# Altium schematic sheet PowerSupply.SchDoc
size 420 x 297 mm; SheetNumber: 4; SheetTotal: 4
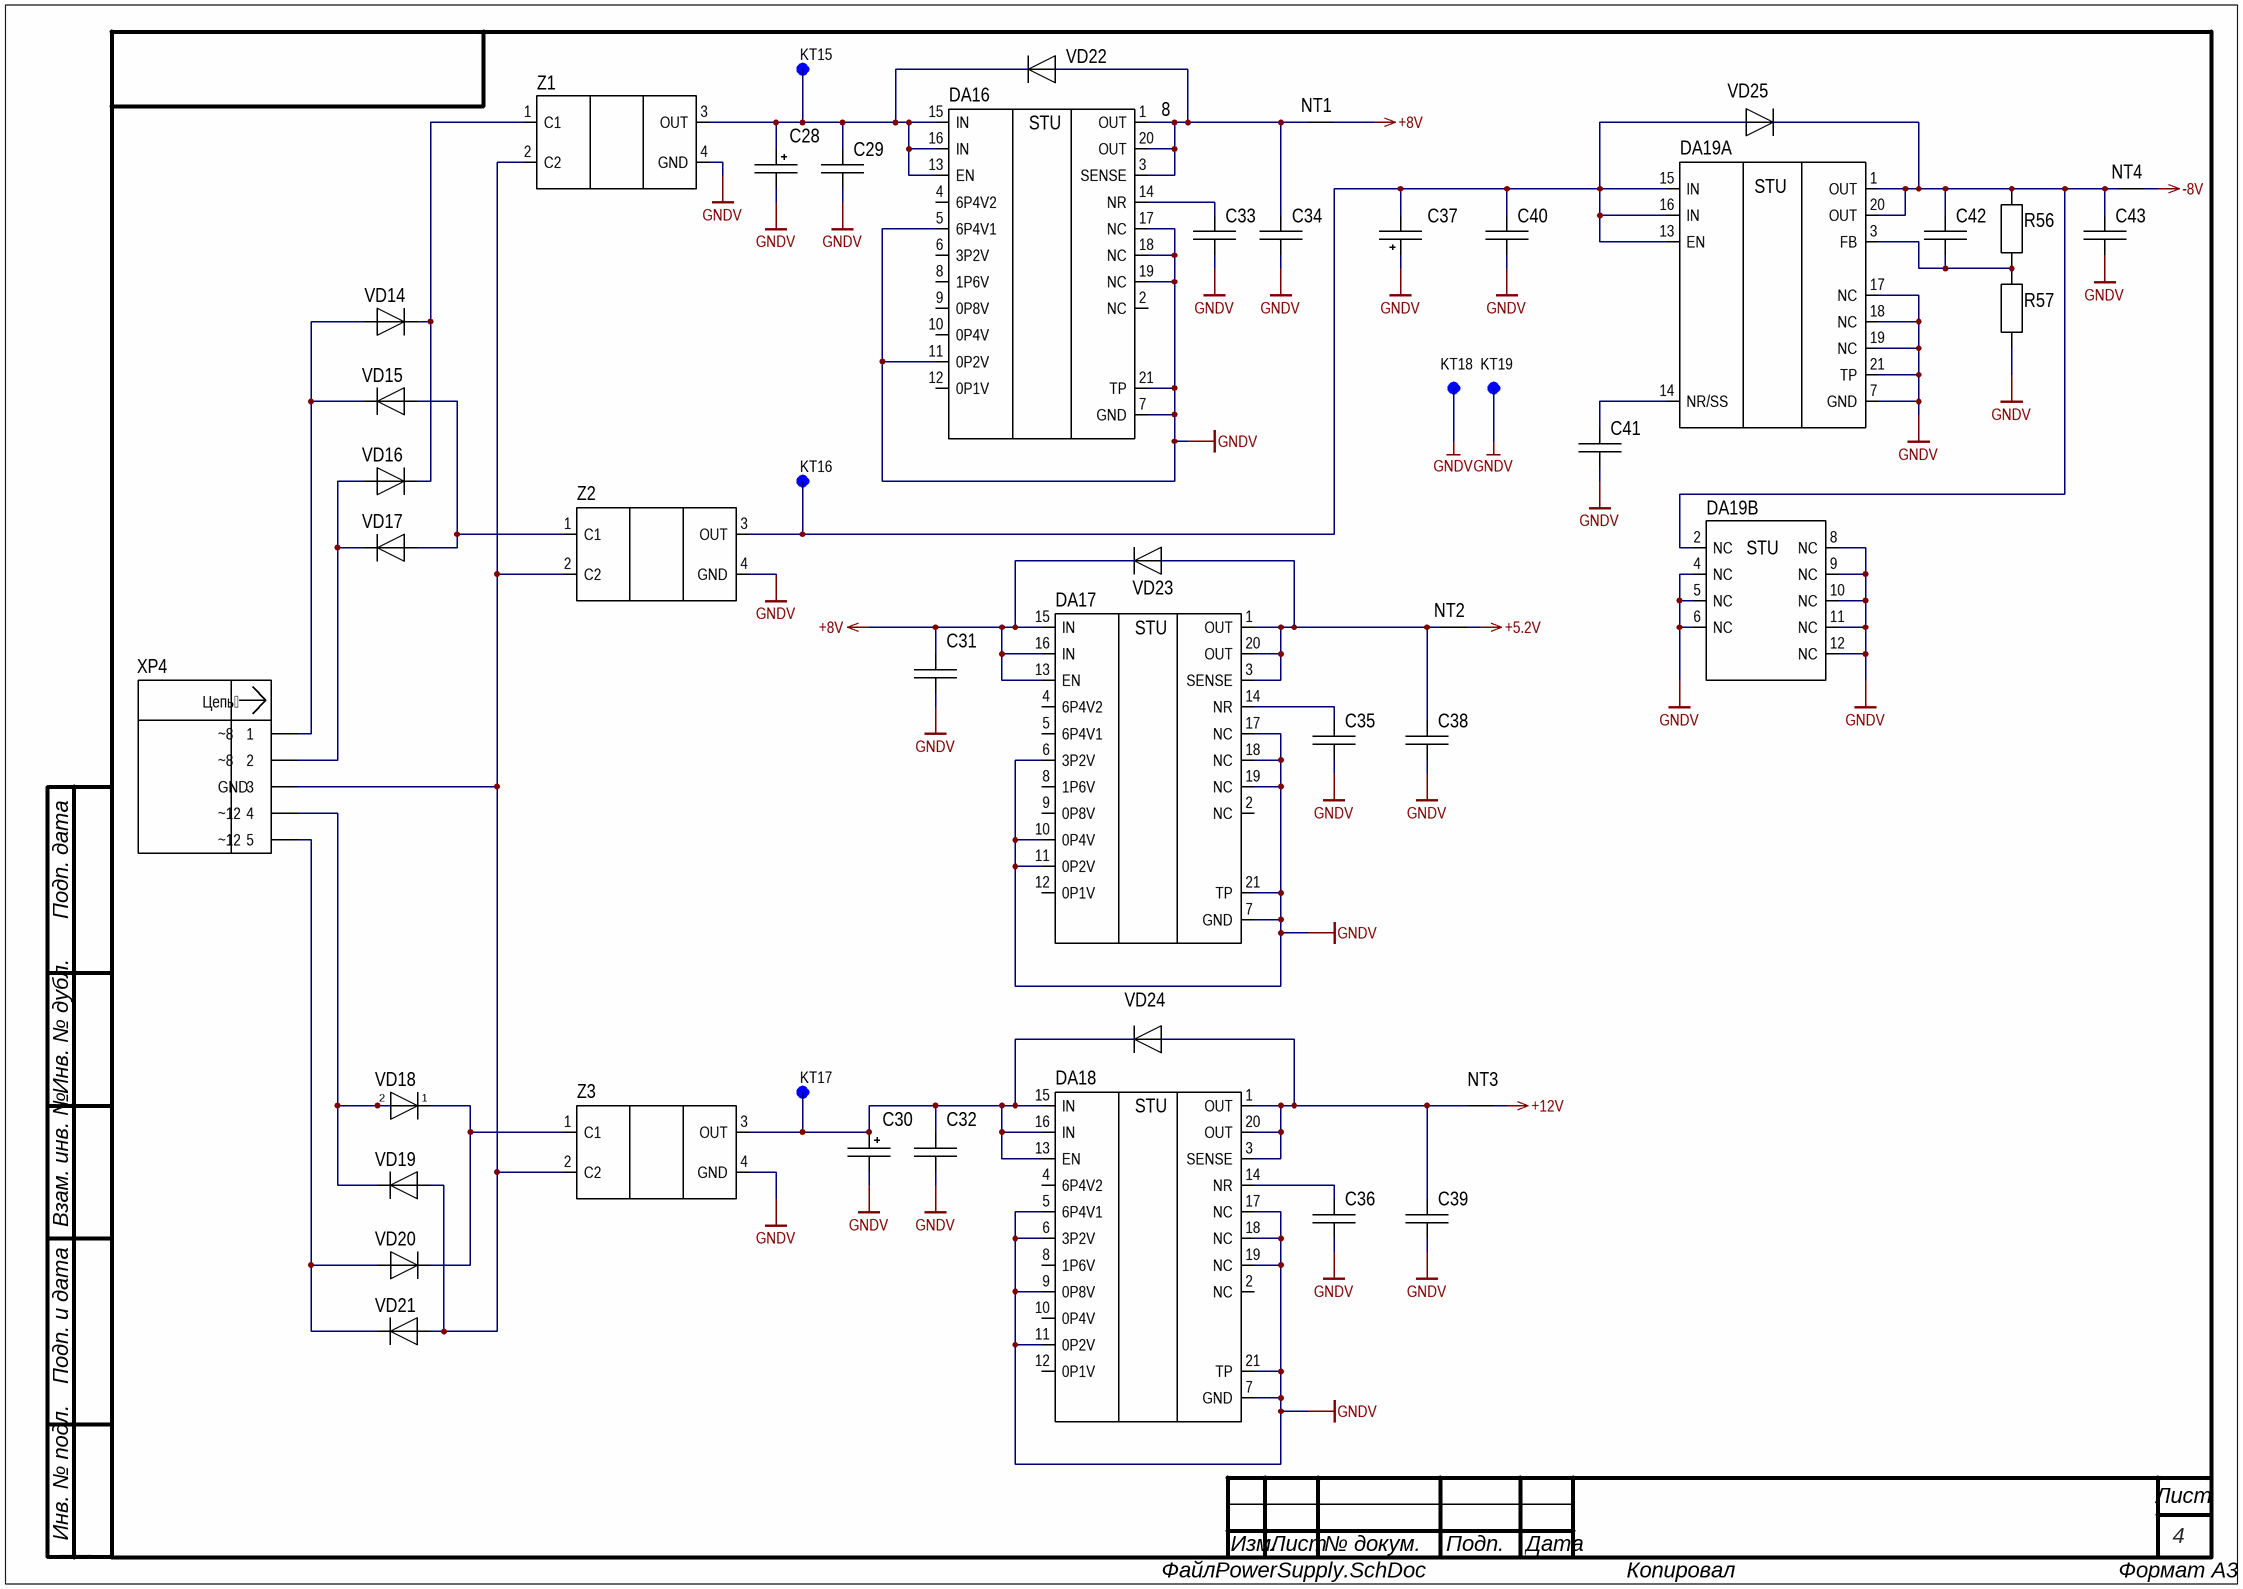
[diagram p0: PowerSupply.SchDoc]

## Parts
C28  JRB-25В-1000 мкФ  [CAP TH ALUM ELEC D10.00mm S5.00mm H21.00mm]  (value not drawn)
C29  1206-X7R-50 B-10 мкФ+-10%  [CAP: 1206]  (value not drawn)
C30  JRB-35В-470мкФ  [CAP TH ALUM ELEC D10.00mm S5.00mm H17.00mm]  (value not drawn)
C31  1206-X7R-50 B-10 мкФ+-10%  [CAP: 1206]  (value not drawn)
C32  1206-X7R-50 B-10 мкФ+-10%  [CAP: 1206]  (value not drawn)
C33  0805-X7R-25 В-1 мкФ +-10%  [CAP: 0805]  (value not drawn)
C34  1206-X7R-25 B-47мкФ+-10%  [CAP: 1206]  (value not drawn)
C35  0805-X7R-25 В-1 мкФ +-10%  [CAP: 0805]  (value not drawn)
C36  0805-X7R-25 В-1 мкФ +-10%  [CAP: 0805]  (value not drawn)
C37  JRB-25В-220мкФ  [CAP TH ALPOLY D8.00mm S3.50mm H12.00mm]  (value not drawn)
C38  1206-X7R-25 B-47мкФ+-10%  [CAP: 1206]  (value not drawn)
C39  1206-X7R-25 B-47мкФ+-10%  [CAP: 1206]  (value not drawn)
C40  1206-X7R-50 B-10 мкФ+-10%  [CAP: 1206]  (value not drawn)
C41  0805-X7R-25 В-1 мкФ +-10%  [CAP: 0805]  (value not drawn)
C42  1206-X7R-50 B-0,01 мкФ+-10%  [CAP: 1206]  (value not drawn)
C43  1206-X7R-25 B-47мкФ+-10%  [CAP: 1206]  (value not drawn)
DA16  TPS7A4701  [20-VQFN]  (value not drawn)
DA17  TPS7A4701  [20-VQFN]  (value not drawn)
DA18  TPS7A4701  [20-VQFN]  (value not drawn)
DA19  TPS7A3301  [20-VQFN]  (value not drawn)  (parts A,B of 2)
KT15  OTV10  [OTV10]  (value not drawn)  (no BOM)
KT16  OTV10  [OTV10]  (value not drawn)  (no BOM)
KT17  OTV10  [OTV10]  (value not drawn)  (no BOM)
KT18  OTV10  [OTV10]  (value not drawn)  (no BOM)
KT19  OTV10  [OTV10]  (value not drawn)  (no BOM)
NT1  NetTie  [NetTie]  (value not drawn)  (net tie, no BOM)
NT2  NetTie  [NetTie]  (value not drawn)  (net tie, no BOM)
NT3  NetTie  [NetTie]  (value not drawn)  (net tie, no BOM)
NT4  NetTie  [NetTie]  (value not drawn)  (net tie, no BOM)
R56  1206-1,24 МОм+-1%  [1206]  (value not drawn)
R57  1206-221 кОм+-1%  [1206]  (value not drawn)
VD14  V1P22  [DO-219AD]  (value not drawn)
VD15  V1P22  [DO-219AD]  (value not drawn)
VD16  V1P22  [DO-219AD]  (value not drawn)
VD17  V1P22  [DO-219AD]  (value not drawn)
VD18  V1P22  [DO-219AD]  (value not drawn)
VD19  V1P22  [DO-219AD]  (value not drawn)
VD20  V1P22  [DO-219AD]  (value not drawn)
VD21  V1P22  [DO-219AD]  (value not drawn)
VD22  1N4148WS  [SOD-323F]  (value not drawn)
VD23  1N4148WS  [SOD-323F]  (value not drawn)
VD24  1N4148WS  [SOD-323F]  (value not drawn)
VD25  1N4148WS  [SOD-323F]  (value not drawn)
XP4  DS1074-5MVT6  [DS1074-5MV]  (value not drawn)
Z1  BNX022-01  [BNX02]  (value not drawn)
Z2  BNX022-01  [BNX02]  (value not drawn)
Z3  BNX022-01  [BNX02]  (value not drawn)

## Nets
+5.2V: NT2.2(N2)
+8V: C31.2 DA17.13(EN) DA17.15(IN) DA17.16(IN) NT1.2(N2) VD23.1
+12V: NT3.2(N2)
-8V: NT4.2(N2)
GNDV: C28.2 C29.1 C30.2 C31.1 C32.1 C33.1 C34.1 C35.1 C36.1 C37.1 C38.1 C39.1 C40.1 C41.1 C43.1 DA16.5(6P4V1) DA16.7(GND) DA16.11(0P2V) DA16.17(NC) DA16.18(NC) DA16.19(NC) DA16.21(TP) DA17.6(3P2V) DA17.7(GND) DA17.10(0P4V) DA17.11(0P2V) DA17.17(NC) DA17.18(NC) DA17.19(NC) DA17.21(TP) DA18.5(6P4V1) DA18.6(3P2V) DA18.7(GND) DA18.9(0P8V) DA18.11(0P2V) DA18.17(NC) DA18.18(NC) DA18.19(NC) DA18.21(TP) DA19.4(NC) DA19.5(NC) DA19.6(NC) DA19.7(GND) DA19.8(NC) DA19.9(NC) DA19.10(NC) DA19.11(NC) DA19.12(NC) DA19.17(NC) DA19.18(NC) DA19.19(NC) DA19.21(TP) KT18.1 KT19.1 R57.1 Z1.4(GND) Z2.4(GND) Z3.4(GND)
NetC28_1: C28.1 C29.2 DA16.13(EN) DA16.15(IN) DA16.16(IN) KT15.1 VD22.1 Z1.3(OUT)
NetC30_1: C30.1 C32.2 DA18.13(EN) DA18.15(IN) DA18.16(IN) KT17.1 VD24.1 Z3.3(OUT)
NetC33_2: C33.2 DA16.14(NR)
NetC34_2: C34.2 DA16.1(OUT) DA16.3(SENSE) DA16.20(OUT) NT1.1(N1) VD22.2
NetC35_2: C35.2 DA17.14(NR)
NetC36_2: C36.2 DA18.14(NR)
NetC37_2: C37.2 C40.2 DA19.13(EN) DA19.15(IN) DA19.16(IN) KT16.1 VD25.2 Z2.3(OUT)
NetC38_2: C38.2 DA17.1(OUT) DA17.3(SENSE) DA17.20(OUT) NT2.1(N1) VD23.2
NetC39_2: C39.2 DA18.1(OUT) DA18.3(SENSE) DA18.20(OUT) NT3.1(N1) VD24.2
NetC41_2: C41.2 DA19.14(NR/SS)
NetC42_1: C42.1 DA19.3(FB) R56.1 R57.2
NetC42_2: C42.2 C43.2 DA19.1(OUT) DA19.2(NC) DA19.20(OUT) NT4.1(N1) R56.2 VD25.1
NetVD14_1: VD14.1(Cathode) VD16.1(Cathode) Z1.1(С1)
NetVD14_2: VD14.2(Anode) VD15.1(Cathode) XP4.1
NetVD15_2: VD15.2(Anode) VD17.2(Anode) Z2.1(С1)
NetVD16_2: VD16.2(Anode) VD17.1(Cathode) XP4.2
NetVD18_1: VD18.1(Cathode) VD20.1(Cathode) Z3.1(С1)
NetVD18_2: VD18.2(Anode) VD19.1(Cathode) XP4.4
NetVD19_2: VD19.2(Anode) VD21.2(Anode) XP4.3 Z1.2(C2) Z2.2(C2) Z3.2(C2)
NetVD20_2: VD20.2(Anode) VD21.1(Cathode) XP4.5

Not connected (* = marked no-connect by the designer): DA16 2(NC) 4(6P4V2) 6(3P2V) 8(1P6V) 9(0P8V) 10(0P4V) 12(0P1V); DA17 2(NC) 4(6P4V2) 5(6P4V1) 8(1P6V) 9(0P8V) 12(0P1V); DA18 2(NC) 4(6P4V2) 8(1P6V) 10(0P4V) 12(0P1V)

## Notes on the sheet
- (near DA16) 8
- Подп. дата
- Инв. № дубл.
- Взам. инв. №
- Подп. и дата
- Инв. № подл.
- Изм.
- Лист
- № докум.
- Подп.
- Дата
- ALTIUM GOSTBOM2.0 KEV
- Файл:
- Копировал
- Формат А3
- (in symbol DS1074-5MVT6) Цепь
- (in symbol TPS7A3301, part A) STU
- (in symbol TPS7A3301, part B) STU
- (in symbol TPS7A4701) STU

## Library data of the parts
C29 C31 C32 C40 = 1206-X7R-50 B-10 мкФ+-10%: Value: 10 мкФ
C33 C35 C36 C41 = 0805-X7R-25 В-1 мкФ +-10%: Value: 1 мкФ
C34 C38 C39 C43 = 1206-X7R-25 B-47мкФ+-10%: Value: 51 пФ
DA16-DA18 = TPS7A4701: TPS7A470x 36-V, 1-A, 4-µVRMS, RF LDO Voltage Regulator
DA19 = TPS7A3301: TPS7A33 –36-V, 1-A, Ultralow-Noise Negative Voltage Regulator
R57 = 1206-221 кОм+-1%: Value: 221 кОм; ModelPrint: 1206
VD14-VD21 = V1P22: Surface-Mount TMBS® (Trench MOS Barrier Schottky) Rectifier; Value: *
VD22-VD25 = 1N4148WS: Small Signal Fast Switching Diod; Value: *
XP4 = DS1074-5MVT6: 1: ~8; 3: GND; 4: ~12; 2: ~8; 5: ~12
C42 = 1206-X7R-50 B-0,01 мкФ+-10%: Value: 0,01 мкФ
R56 = 1206-1,24 МОм+-1%: ModelPrint: 1206; Value: 1,24 МОм